# EasyEDA Pro project ProPrj_阿加犀_2025-08-19.epro

# Schematic Schematic1
Board Name: Holiday; Create Date: 2025-07-15; Page Name: P1; Project Name: 阿加犀; Schematic Name: Schematic1; Update Date: 2025-07-24; Company: 嘉立创EDA; Page Size: A4; Version: V1.0
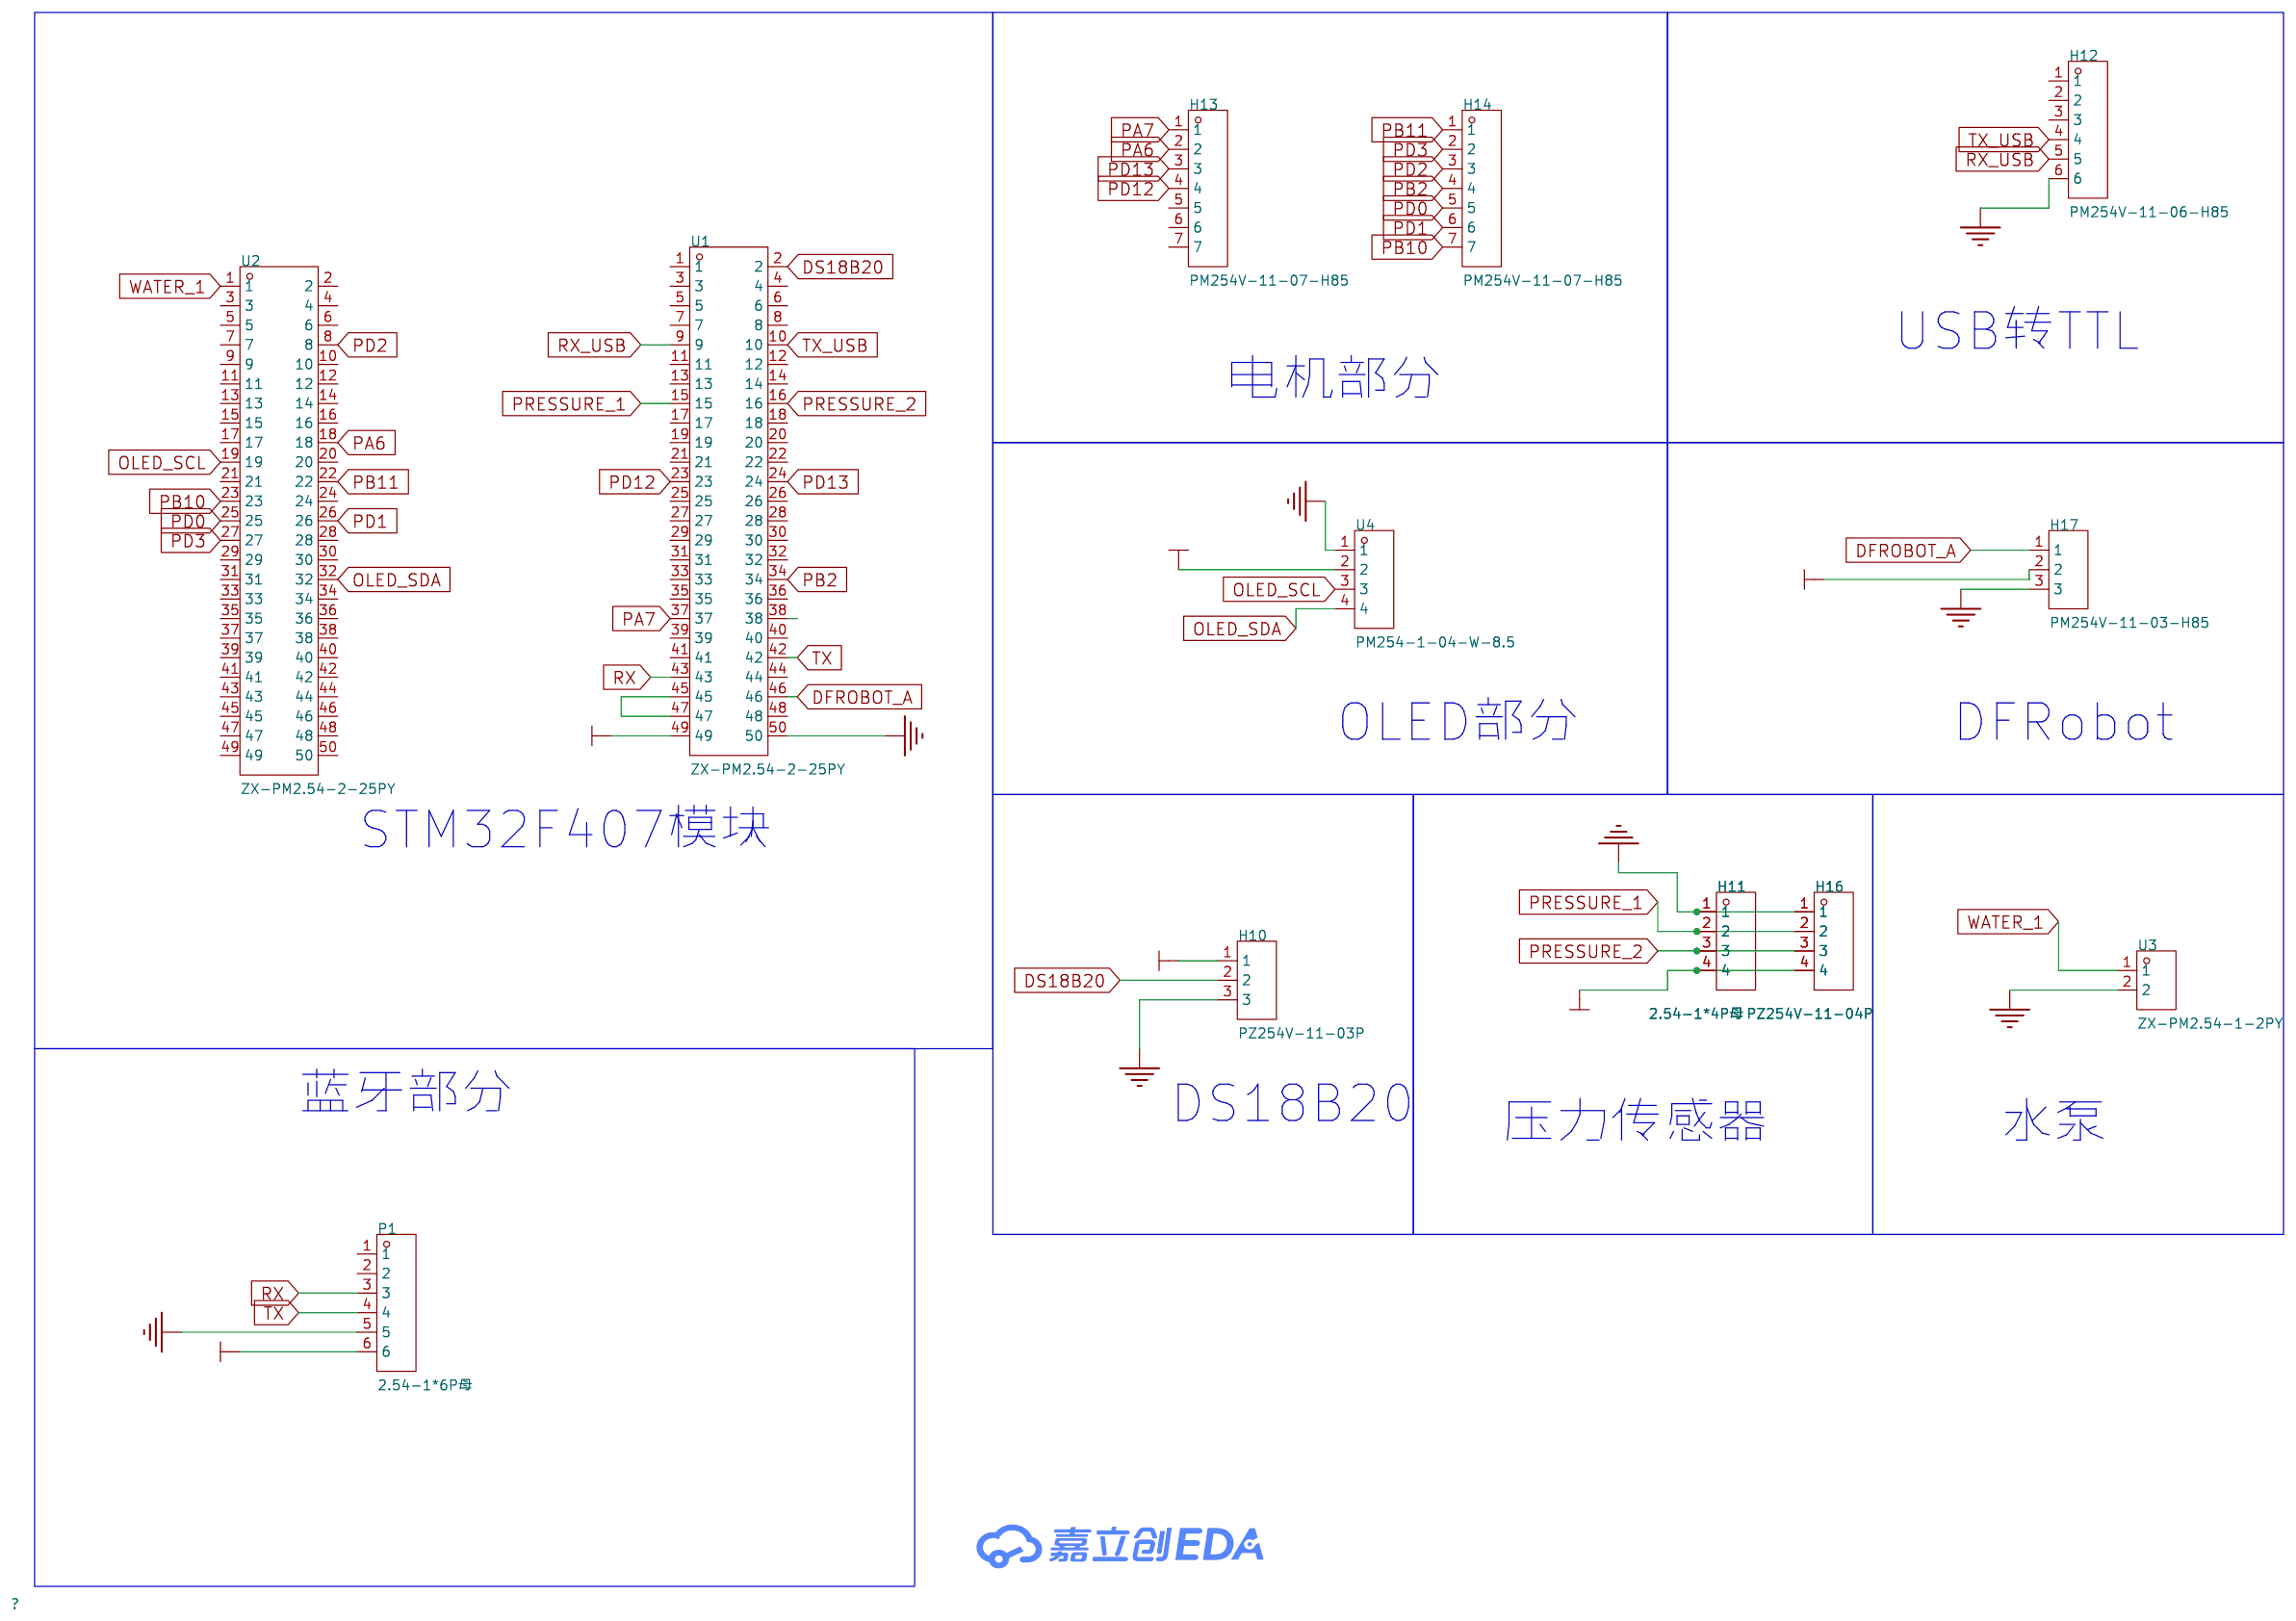
[diagram p0: schematic sheet]

## Parts
H10  PZ254V-11-03P  [HDR-TH_3P-P2.54-V-M]
H11  2.54-1*4P母  [HDR-TH_4P-P2.54-V-F]
H12  PM254V-11-06-H85  [HDR-TH_6P-P2.54-V-F]
H13  PM254V-11-07-H85  [HDR-TH_7P-P2.54-V-F]
H14  PM254V-11-07-H85  [HDR-TH_7P-P2.54-V-F]
H16  PZ254V-11-04P  [HDR-TH_4P-P2.54-V-M]
H17  PM254V-11-03-H85  [HDR-TH_3P-P2.54-V-F]
P1  2.54-1*6P母  [HDR-TH_6P-P2.54-V-F]
U1  ZX-PM2.54-2-25PY  [HDR-TH_50P-P2.54-V-F-R2-C25-S2.54-1]
U2  ZX-PM2.54-2-25PY  [HDR-TH_50P-P2.54-V-F-R2-C25-S2.54-1]
U3  ZX-PM2.54-1-2PY  [HDR-TH_2P-P2.54-V-F]
U4  PM254-1-04-W-8.5  [HDR-TH_4P-P2.54-H-F-W10.0-N]

## Library data of the parts
H10 = PZ254V-11-03P: 插针结构:1x3P;间距:2.54mm;行距:-;圆针/方针:方针;安装方式:直插;排数:单排;总PIN位数:3P;额定电流:3A;额定电压:250V;配合针长度:6mm;塑高:2.5mm;端接针长度:3mm;工作温度:-40℃~+105℃;颜色:黑色;; LCSC Part Name: 1x3P 间距:2.54mm 方针 直插; Supplier Part: C2937625; Manufacturer: XFCN(兴飞); Supplier Footprint: 插件,P=2.54mm; JLCPCB Part Class: 扩展库; Datasheet: https://atta.szlcsc.com/upload/public/pdf/source/20200309/C492402_8335C3D49C4E4C618838D59BB1D024C1.pdf; Supplier: LCSC; Pin Structure: 1x3P; Pitch: 2.54mm; Circluar Pins/Square Pins: 方针; Mounting Type: 直插; Number of Rows: 单排; Number of Pins: 3P; Current Rating: 3A; Voltage Rating (Max): 250V; Length of Mating Pin: 6mm; Insulation Height: 2.5mm; Length of End Connection Pin: 3mm; Operating Temperature: -40℃~+105℃; Color: 黑色
H11 = 2.54-1*4P母: 插孔结构:1x4P;间距:2.54mm;行距:-;圆孔/方孔:方孔;安装类型:直插;排数:单排;总孔位数:4P;额定电流:3A;额定电压:-;插孔方向:顶部;塑高:-;触头材质:青铜;触头镀层:-;工作温度范围:-40℃~+105℃;焊接温度(最大值):-;; LCSC Part Name: 间距:2.54mm 1x4P 直插; Supplier Part: C2718488; Manufacturer: BOOMELE(博穆精密); Supplier Footprint: 插件,P=2.54mm; JLCPCB Part Class: 扩展库; Datasheet: https://atta.szlcsc.com/upload/public/pdf/source/20210301/C2718488_F4427B881E42CAA8DDB0B1C12B3A522C.pdf; Supplier: LCSC; Holes Structure: 1x4P; Pitch: 2.54mm; Circular Hole / Square Hole: 方孔; Mounting Type: 直插; Number of Rows: 单排; Number of Holes: 4P; Current Rating (Max): 3A; Holes Direction: 顶部; Contact Material: 青铜; Operating Temperature Range: -40℃~+105℃
H12 = PM254V-11-06-H85: 插孔结构:1x6P;间距:2.54mm;行距:-;圆孔/方孔:方孔;安装类型:直插;排数:单排;总孔位数:6P;额定电流:3A;额定电压:250V;插孔方向:顶部;塑高:-;工作温度范围:-40℃~+105℃;; LCSC Part Name: 间距:2.54mm 1x6P 直插; Supplier Part: C2832269; Manufacturer: XFCN(兴飞); Supplier Footprint: 插件,P=2.54mm; JLCPCB Part Class: 扩展库; Datasheet: https://atta.szlcsc.com/upload/public/pdf/source/20210514/C2832269_B3EC97736B37C2783BDCE3050AA57447.pdf; Supplier: LCSC; Holes Structure: 1x6P; Pitch: 2.54mm; Circular Hole / Square Hole: 方孔; Mounting Type: 直插; Number of Rows: 单排; Number of Holes: 6P; Current Rating (Max): 3A; Voltage Rating (Max): 250V; Holes Direction: 顶部; Operating Temperature Range: -40℃~+105℃
H13 H14 = PM254V-11-07-H85: 插孔结构:1x7P;间距:2.54mm;行距:-;圆孔/方孔:方孔;安装类型:直插;排数:单排;总孔位数:7P;额定电流:3A;额定电压:250V;插孔方向:顶部;塑高:-;工作温度范围:-40℃~+105℃;; LCSC Part Name: 间距:2.54mm 1x7P 直插; Supplier Part: C2832270; Manufacturer: XFCN(兴飞); Supplier Footprint: 插件,P=2.54mm; JLCPCB Part Class: 扩展库; Datasheet: https://atta.szlcsc.com/upload/public/pdf/source/20210514/C2832270_F424CC0071A81298BFB56B53406F9842.pdf; Supplier: LCSC; Holes Structure: 1x7P; Pitch: 2.54mm; Circular Hole / Square Hole: 方孔; Mounting Type: 直插; Number of Rows: 单排; Number of Holes: 7P; Current Rating (Max): 3A; Voltage Rating (Max): 250V; Holes Direction: 顶部; Operating Temperature Range: -40℃~+105℃
H16 = PZ254V-11-04P: 插针结构:1x4P;间距:2.54mm;行距:-;圆针/方针:方针;安装类型:直插;排数:单排;总PIN位数:4P;额定电流:3A;额定电压:250V;配合针长度:6mm;塑高:2.5mm;端接针长度:3mm;触头材质:-;工作温度范围:-40℃~+105℃;颜色:黑色;; LCSC Part Name: 间距:2.54mm 1x4P 直插 方针; Supplier Part: C2691448; Manufacturer: XFCN(兴飞); Supplier Footprint: 插件,P=2.54mm; JLCPCB Part Class: 扩展库; Datasheet: https://atta.szlcsc.com/upload/public/pdf/source/20200309/C492403_F9F19131791D08044AD4F84F8E751A34.pdf; Supplier: LCSC; Pin Structure: 1x4P; Pitch: 2.54mm; Circluar Pins/Square Pins: 方针; Mounting Type: 直插; Number of Rows: 单排; Number of Pins: 4P; Current Rating (Max): 3A; Voltage Rating (Max): 250V; Length of Mating Pin: 6mm; Insulation Height: 2.5mm; Length of End Connection Pin: 3mm; Operating Temperature Range: -40℃~+105℃; Color: 黑色
H17 = PM254V-11-03-H85: 插孔结构:1x3P;间距:2.54mm;行距:-;安装类型:直插;排数:单排;总孔位数:3P;塑高:-;触头材质:黄铜;触头镀层:-;; LCSC Part Name: 间距:2.54mm 1x3P 直插; Supplier Part: C541850; Manufacturer: XFCN(兴飞); Supplier Footprint: 插件,P=2.54mm; JLCPCB Part Class: 扩展库; Datasheet: https://atta.szlcsc.com/upload/public/pdf/source/20200518/C541849_85853D71FC67C51915A806977A588FDA.pdf; Supplier: LCSC; Holes Structure: 1x3P; Pitch: 2.54mm; Mounting Type: 直插; Number of Rows: 单排; Number of Holes: 3P; Contact Material: 黄铜
P1 = 2.54-1*6P母: 插孔结构:1x6P;间距:2.54mm;行距:-;安装类型:直插;排数:单排;总孔位数:6P;塑高:-;触头材质:-;触头镀层:-;; LCSC Part Name: 间距:2.54mm 1x6P 直插; Supplier Part: C40877; Manufacturer: BOOMELE(博穆精密); Supplier Footprint: 插件,P=2.54mm; JLCPCB Part Class: 扩展库; Datasheet: https://atta.szlcsc.com/upload/public/pdf/source/20210301/C2718488_F4427B881E42CAA8DDB0B1C12B3A522C.pdf; Supplier: LCSC; Holes Structure: 1x6P; Pitch: 2.54mm; Mounting Type: 直插; Number of Rows: 单排; Number of Holes: 6P
U1 U2 = ZX-PM2.54-2-25PY: 插孔结构:2x25P;间距:2.54mm;行距:2.54mm;圆孔/方孔:方孔;安装方式:直插;排数:双排;总孔位数:50P;额定电流:3A;额定电压:-;插孔方向:顶部;塑高:8.5mm;触头材质:-;触头镀层:金;工作温度:-40℃~+105℃;; LCSC Part Name: 2x25P 间距:2.54mm 直插; Supplier Part: C7499355; Manufacturer: Megastar(兆星); Supplier Footprint: 插件,P=2.54mm; JLCPCB Part Class: 扩展库; Datasheet: https://atta.szlcsc.com/upload/public/pdf/source/20231122/49E5BFC403566950E1C41AC60FCE7E93.pdf; Supplier: LCSC; Holes Structure: 2x25P; Pitch: 2.54mm; Row Spacing: 2.54mm; Circular Hole / Square Hole: 方孔; Mounting Type: 直插; Number of Rows: 双排; Number of Positions: 50P; Current Rating: 3A; Holes Direction: 顶部; Insulation Height: 8.5mm; Contact Plating: 金; Operating Temperature: -40℃~+105℃; PIN Length: 3.2mm
U3 = ZX-PM2.54-1-2PY: 插孔结构:1x2P;间距:2.54mm;行距:-;圆孔/方孔:方孔;安装方式:直插;排数:单排;总孔位数:2P;额定电流:3A;额定电压:-;插孔方向:顶部;塑高:8.5mm;触头材质:-;触头镀层:金;工作温度:-40℃~+105℃;; LCSC Part Name: 1x2P 间距:2.54mm 直插; Supplier Part: C7499322; Manufacturer: Megastar(兆星); Supplier Footprint: 插件,P=2.54mm; JLCPCB Part Class: 扩展库; Datasheet: https://atta.szlcsc.com/upload/public/pdf/source/20231122/F22175ABE3DCBFEB9E36A2E7DA44623C.pdf; Supplier: LCSC; Holes Structure: 1x2P; Pitch: 2.54mm; Circular Hole / Square Hole: 方孔; Mounting Type: 直插; Number of Rows: 单排; Number of Positions: 2P; Current Rating: 3A; Holes Direction: 顶部; Insulation Height: 8.5mm; Contact Plating: 金; Operating Temperature: -40℃~+105℃; PIN Length: 3.2mm
U4 = PM254-1-04-W-8.5: 插孔结构:1x4P;间距:2.54mm;行距:-;圆孔/方孔:方孔;安装类型:弯插;排数:单排;总孔位数:4P;额定电流:3A;额定电压:-;插孔方向:侧面;塑高:8.5mm;触头材质:铜合金;工作温度范围:-40℃~+105℃;焊接温度(最大值):260℃@5S;; LCSC Part Name: 1x4P 间距:2.54mm 弯插; Supplier Part: C2897386; Manufacturer: HCTL(华灿天禄); Supplier Footprint: 弯插,P=2.54mm; JLCPCB Part Class: 扩展库; Datasheet: https://atta.szlcsc.com/upload/public/pdf/source/20230609/7BA40A3D721268A082DCDEAD4C99131B.pdf; Supplier: LCSC; Holes Structure: 1x4P; Pitch: 2.54mm; Circular Hole / Square Hole: 方孔; Mounting Type: 弯插; Number of Rows: 单排; Number of Holes: 4P; Current Rating (Max): 3A; Holes Direction: 侧面; Insulation Height: 8.5mm; Contact Material: 铜合金; Operating Temperature Range: -40℃~+105℃; Soldering Temperature(Max): 260℃@5S

## Nets
3.3V: H10.1 H11.4 H16.4 H17.2 P1.6 U1.49 U4.2
GND: H10.3 H11.1 H12.6 H16.1 H17.3 P1.5 U1.50 U3.2 U4.1
DFROBOT_A: H17.1 U1.46
DS18B20: H10.2 U1.2
OLED_SCL: U2.19 U4.3
OLED_SDA: U2.32 U4.4
PA6: H13.2 U2.18
PA7: H13.1 U1.37
PB2: H14.4 U1.34
PB10: H14.7 U2.23
PB11: H14.1 U2.22
PD0: H14.5 U2.25
PD1: H14.6 U2.26
PD2: H14.3 U2.8
PD3: H14.2 U2.27
PD12: H13.4 U1.23
PD13: H13.3 U1.24
PRESSURE_1: H11.2 H16.2 U1.15
PRESSURE_2: H11.3 H16.3 U1.16
RX: P1.3 U1.43
RX_USB: H12.5 U1.9
TX: P1.4 U1.42
TX_USB: H12.4 U1.10
WATER_1: U2.1 U3.1
$1N4979: U1.45 U1.47

Not connected (* = marked no-connect by the designer): H12 1 2 3; H13 5 6 7; P1 1 2; U1 1 3 4 5 6 7 8 11 12 13 14 17 18 19 20 21 22 25 26 27 28 29 30 31 32 33 35 36 38 39 40 41 44 48; U2 2 3 4 5 6 7 9 10 11 12 13 14 15 16 17 20 21 24 28 29 30 31 33 34 35 36 37 38 39 40 41 42 43 44 45 46 47 48 49 50

## Notes on the sheet
- USB转TTL
- 电机部分
- OLED部分
- DFRobot
- STM32F407模块
- 蓝牙部分
- DS18B20
- 压力传感器
- 水泵

# Board PCB1
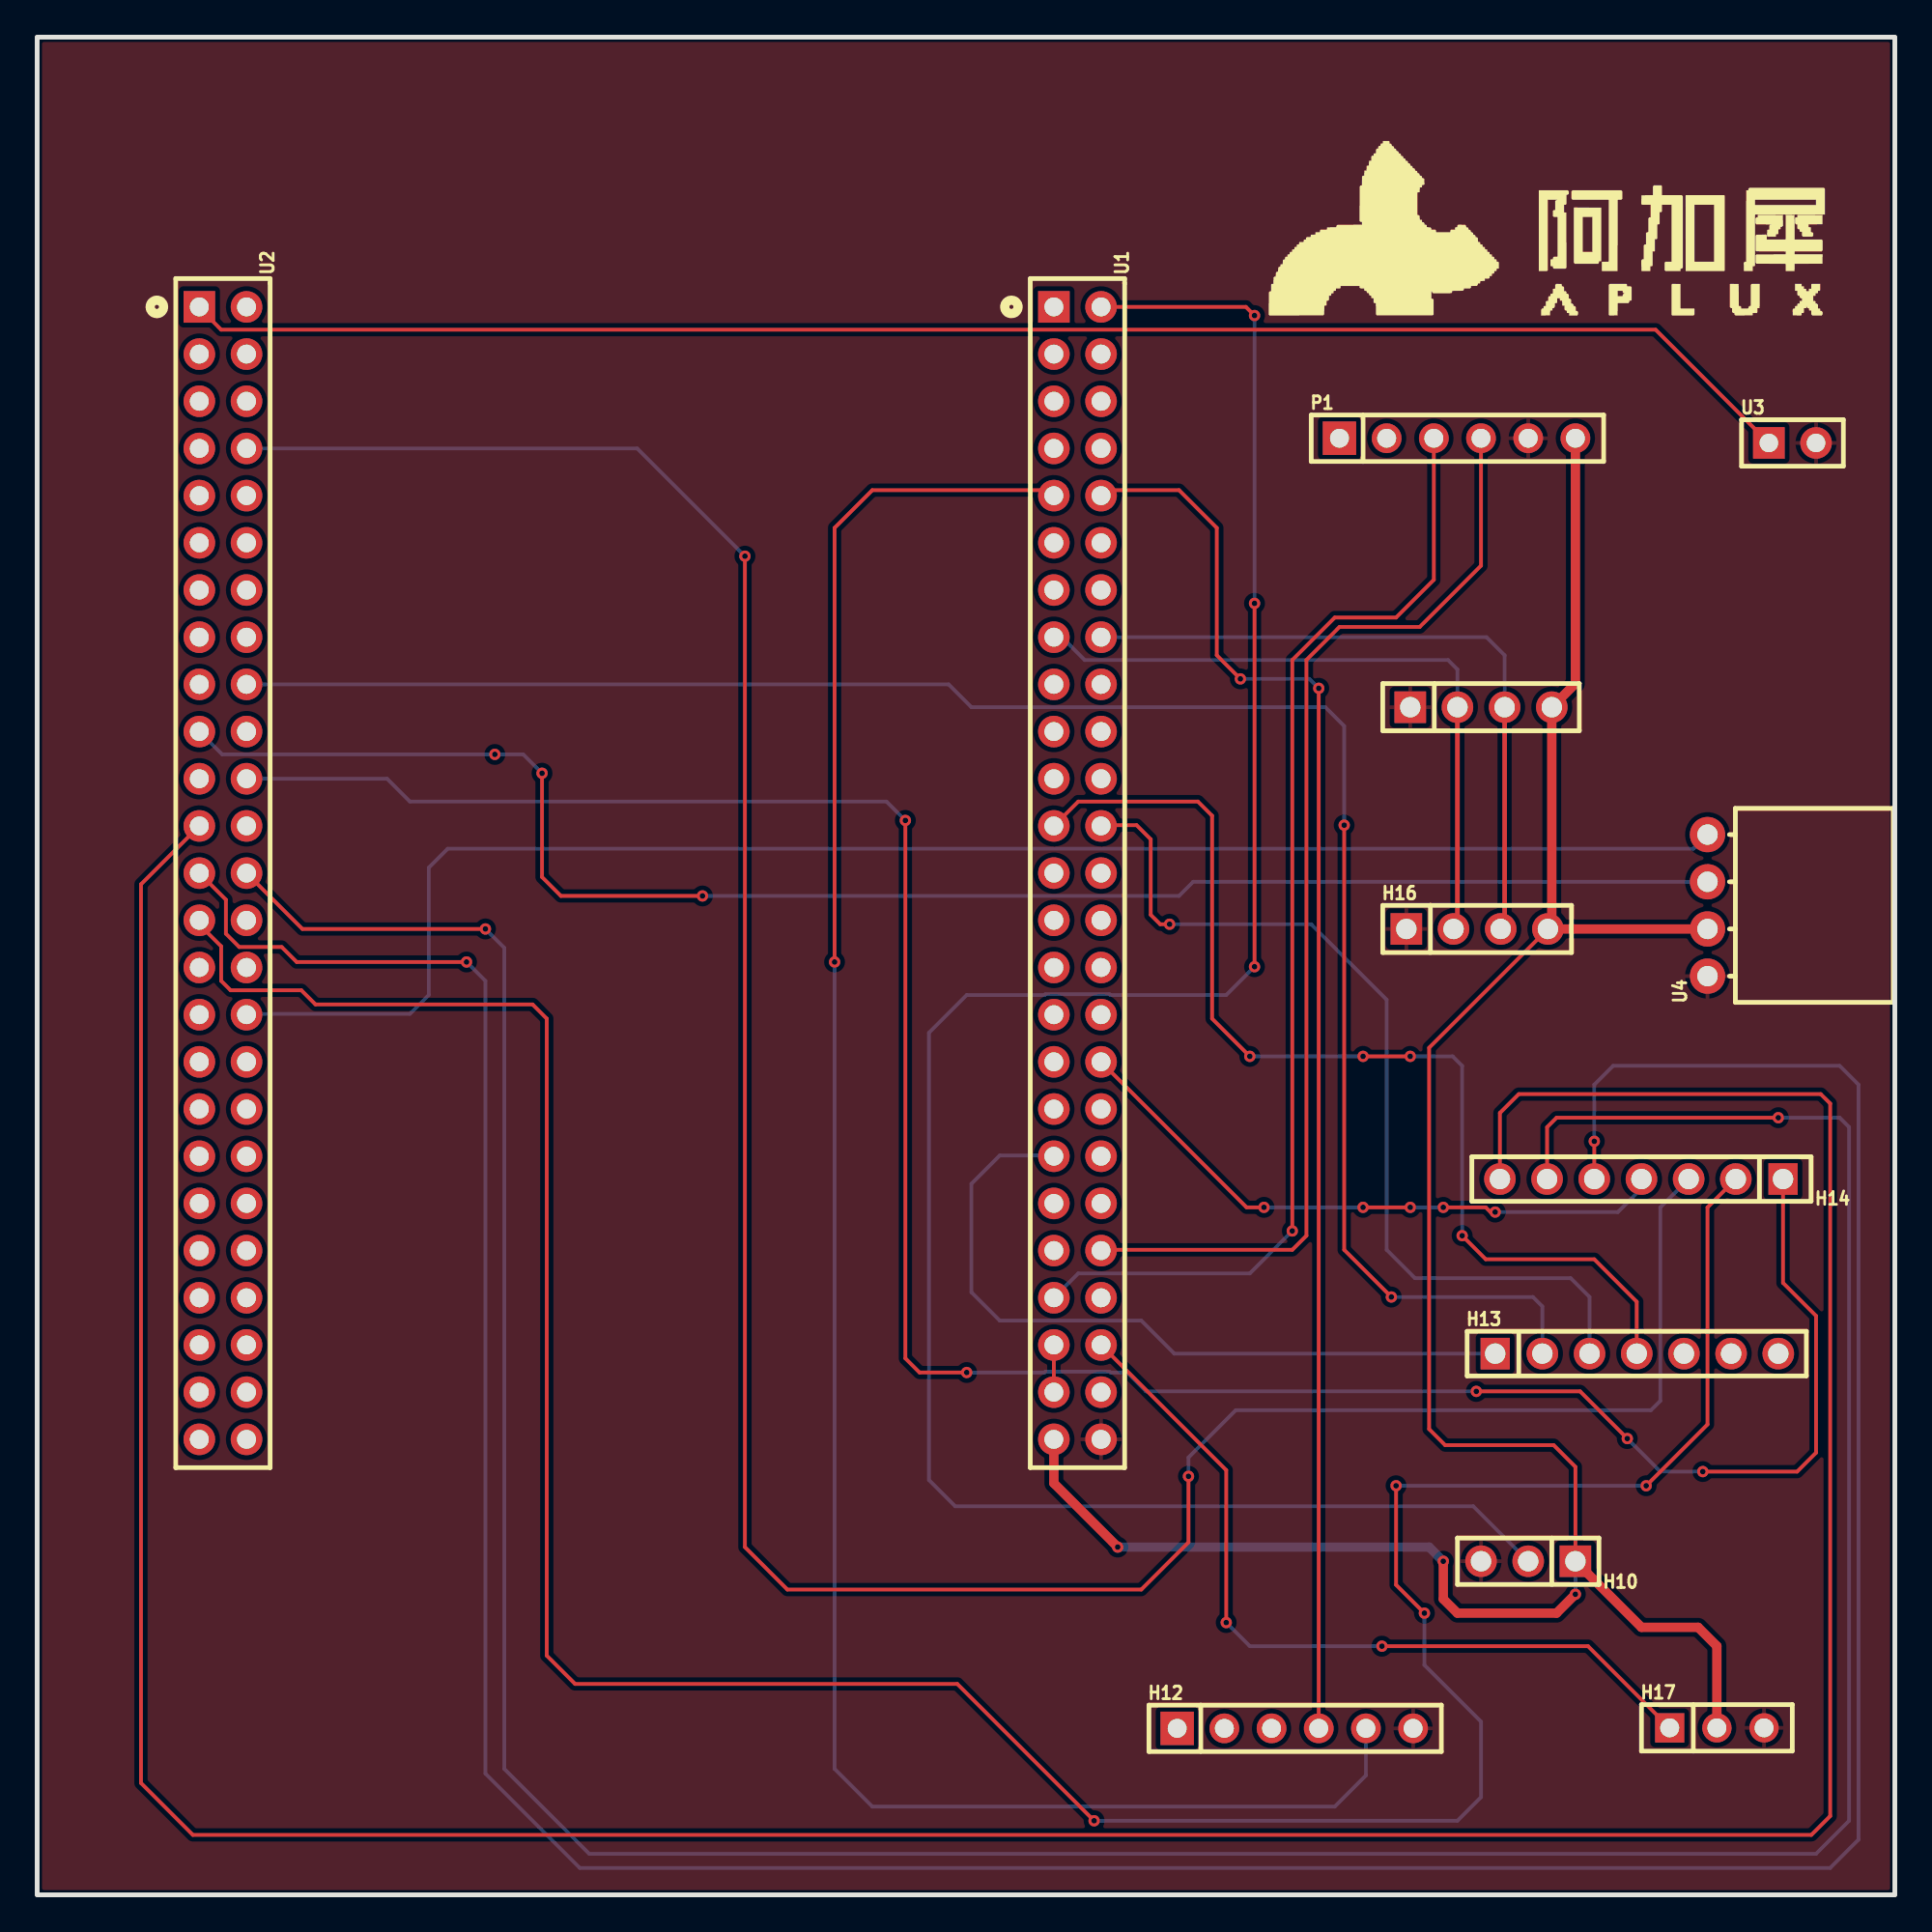
[diagram p1: board, top side]
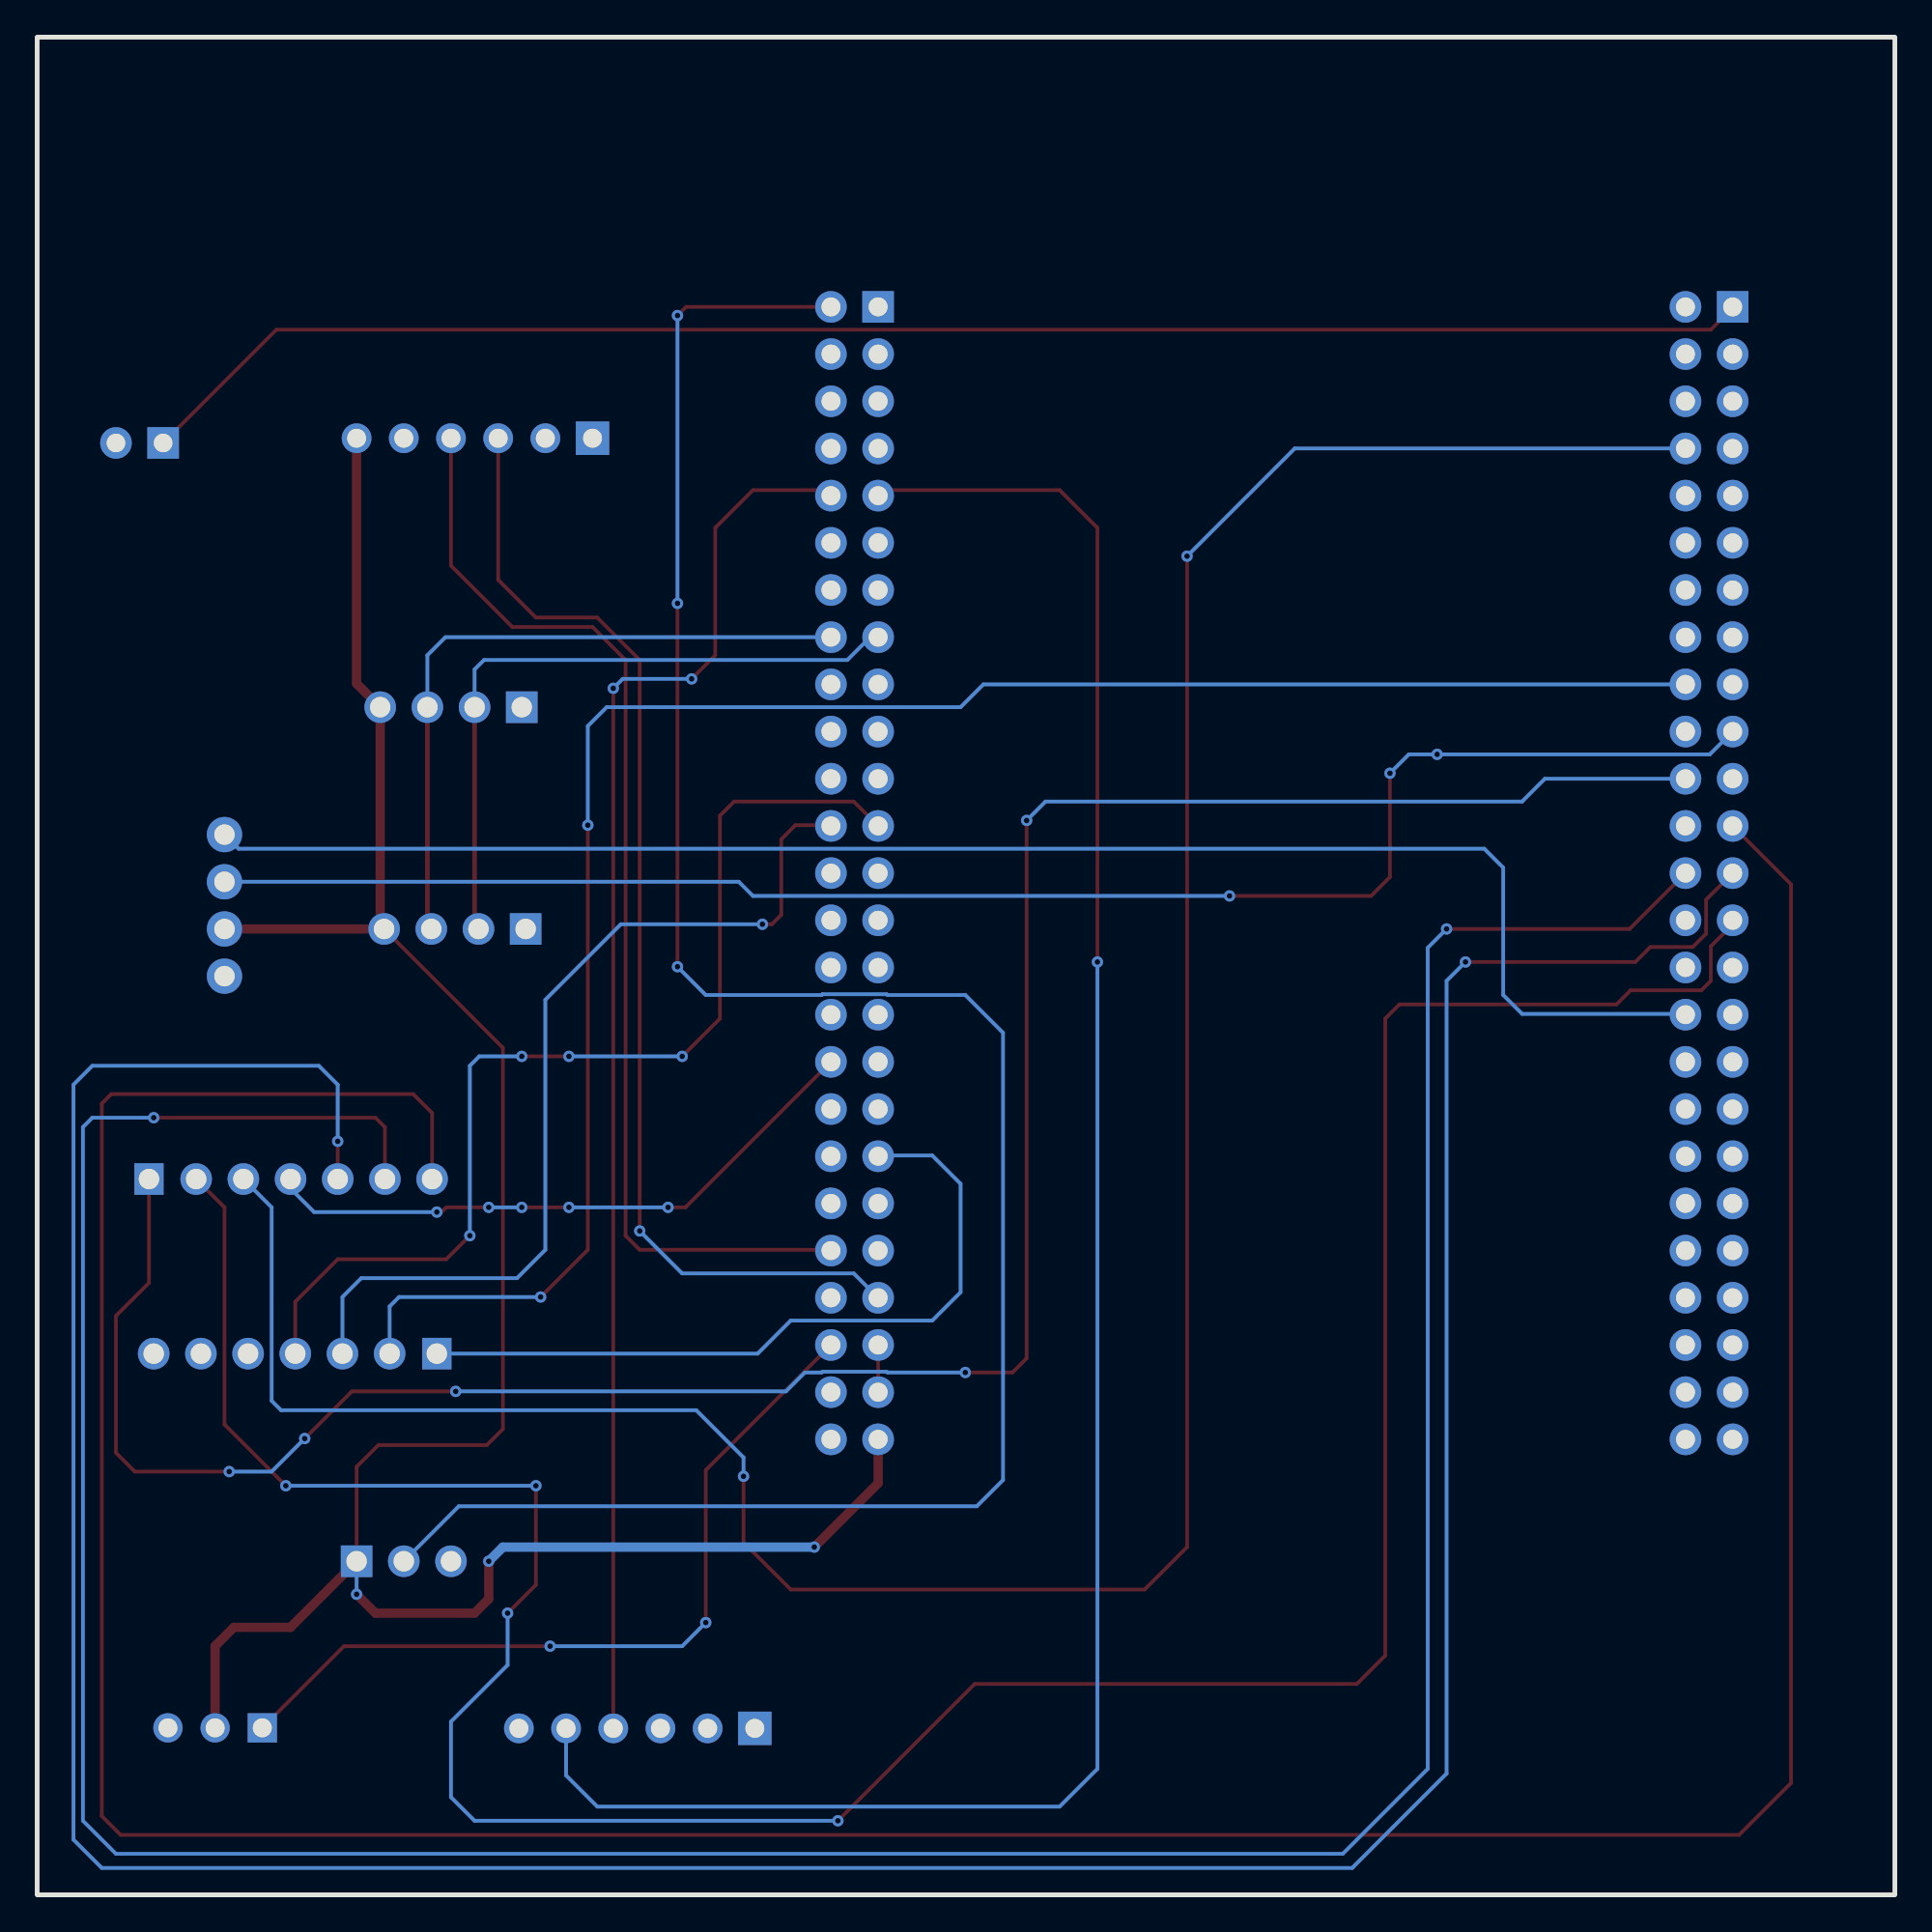
[diagram p2: board, bottom side, seen from below]

Outline 100 x 100 mm; copper layers: Top Layer, Bottom Layer. Coordinates in mm from the lower left corner of the outline.
Outline path: rectangle 0,100 100,0
Stack: Top Layer 0.035mm / Dielectric1 1.51mm FR4 er 4.5 / Bottom Layer 0.035mm

## Design rules (mm)
template: JLCPCB Capability(Two Layers Board)
spacing copperThickness1oz (default): track to track 0.102, other pairs 0.152 to 0.3
spacing copperThickness2oz: track to track 0.203, other pairs 0.152 to 0.3
track width copperThickness1oz (default): min 0.127, default 0.254, max 2.54
track width copperThickness2oz: min 0.203, default 0.254, max 2.54
differential pair differentialPair (default): width min 0.127, default 0.254, max 2.54; gap min 0.152, default 0.152
via viaSize (default): diameter min 0.5, default 0.61, max 10; hole min 0.3, default 0.305, max 6.3

## Placement (name value [footprint] x y rotation side)
H10  PZ254V-11-03P  [HDR-TH_3P-P2.54-V-M]  80.26 17.96 180 top
H11  2.54-1*4P母  [HDR-TH_4P-P2.54-V-F]  77.72 63.93 0 top
H12  PM254V-11-06-H85  [HDR-TH_6P-P2.54-V-F]  67.72 8.96 0 top
H13  PM254V-11-07-H85  [HDR-TH_7P-P2.54-V-F]  86.11 29.13 0 top
H14  PM254V-11-07-H85  [HDR-TH_7P-P2.54-V-F]  86.36 38.53 180 top
H16  PZ254V-11-04P  [HDR-TH_4P-P2.54-V-M]  77.51 51.99 0 top
H17  PM254V-11-03-H85  [HDR-TH_3P-P2.54-V-F]  90.42 8.99 0 top
P1  2.54-1*6P母  [HDR-TH_6P-P2.54-V-F]  76.45 78.41 0 top
U1  ZX-PM2.54-2-25PY  [HDR-TH_50P-P2.54-V-F-R2-C25-S2.54-1]  56 55 270 top
U2  ZX-PM2.54-2-25PY  [HDR-TH_50P-P2.54-V-F-R2-C25-S2.54-1]  10 55 270 top
U3  ZX-PM2.54-1-2PY  [HDR-TH_2P-P2.54-V-F]  94.49 78.16 0 top
U4  PM254-1-04-W-8.5  [HDR-TH_4P-P2.54-H-F-W10.0-N]  89.92 53.26 90 top

## Footprints (pads in the part's own frame, mm; a bottom-side part is the same pattern mirrored in y, then rotated)
HDR-TH_2P-P2.54-V-F
  rect 1.7x1.7 hole 1: 1(-1.27,0)
  round 1.7 hole 1: 2(1.27,0)
HDR-TH_3P-P2.54-V-F
  rect 1.575x1.575 hole 1.02: 1(-2.54,0)
  round 1.575 hole 1.02: 2(0,0) 3(2.54,0)
HDR-TH_3P-P2.54-V-M
  rect 1.7x1.7 hole 1.1: 1(-2.54,0)
  round 1.7 hole 1.1: 2(0,0) 3(2.54,0)
HDR-TH_4P-P2.54-H-F-W10.0-N
  round 1.9 hole 1.1: 1(-3.81,0) 2(-1.27,0) 3(1.27,0) 4(3.81,0)
HDR-TH_4P-P2.54-V-F
  rect 1.7x1.7 hole 1.1: 1(-3.81,0)
  round 1.7 hole 1.1: 2(-1.27,0) 3(1.27,0) 4(3.81,0)
HDR-TH_4P-P2.54-V-M
  rect 1.7x1.7 hole 1.1: 1(-3.81,0)
  round 1.7 hole 1.1: 2(-1.27,0) 3(1.27,0) 4(3.81,0)
HDR-TH_6P-P2.54-V-F
  rect 1.8x1.8 hole 1.02: 1(-6.35,0)
  round 1.6 hole 1.02: 2(-3.81,0) 3(-1.27,0) 4(1.27,0) 5(3.81,0) 6(6.35,0)
HDR-TH_7P-P2.54-V-F
  rect 1.575x1.7 hole 1.1: 1(-7.62,0)
  round 1.7 hole 1.1: 2(-5.08,0) 3(-2.54,0) 4(0,0) 5(2.54,0) 6(5.08,0) 7(7.62,0)
HDR-TH_50P-P2.54-V-F-R2-C25-S2.54-1
  rect 1.7x1.7 hole 1.02: 1(-30.48,-1.27)
  round 1.7 hole 1.02: 2(-30.48,1.27) 3(-27.94,-1.27) 4(-27.94,1.27) 5(-25.4,-1.27) 6(-25.4,1.27) 7(-22.86,-1.27) 8(-22.86,1.27) 9(-20.32,-1.27) 10(-20.32,1.27) 11(-17.78,-1.27) 12(-17.78,1.27) 13(-15.24,-1.27) 14(-15.24,1.27) 15(-12.7,-1.27) 16(-12.7,1.27) 17(-10.16,-1.27) 18(-10.16,1.27) 19(-7.62,-1.27) 20(-7.62,1.27) 21(-5.08,-1.27) 22(-5.08,1.27) 23(-2.54,-1.27) 24(-2.54,1.27) 25(0,-1.27) 26(0,1.27) 27(2.54,-1.27) 28(2.54,1.27) 29(5.08,-1.27) 30(5.08,1.27) 31(7.62,-1.27) 32(7.62,1.27) 33(10.16,-1.27) 34(10.16,1.27) 35(12.7,-1.27) 36(12.7,1.27) 37(15.24,-1.27) 38(15.24,1.27) 39(17.78,-1.27) 40(17.78,1.27) 41(20.32,-1.27) 42(20.32,1.27) 43(22.86,-1.27) 44(22.86,1.27) 45(25.4,-1.27) 46(25.4,1.27) 47(27.94,-1.27) 48(27.94,1.27) 49(30.48,-1.27) 50(30.48,1.27)

## Nets
As in the schematic.

Pads without a net: H12 1 2 3; H13 5 6 7; P1 1 2; U1 1 3 4 5 6 7 8 11 12 13 14 17 18 19 20 21 22 25 26 27 28 29 30 31 32 33 35 36 39 40 41 44 48; U2 2 3 4 5 6 7 9 10 11 12 13 14 15 16 17 20 21 24 28 29 30 31 33 34 35 36 37 38 39 40 41 42 43 44 45 46 47 48 49 50

## Via types
v1: diameter 0.61, hole 0.305, Top Layer to Bottom Layer, 42 vias

## Routing (per net, layer and track width the routed paths; a pad name or vN(x,y) marks a point on that pad's centre or on a via; arc(x,y) is an arc through that point)
3.3V: length 129.6
  Top Layer w0.2: H16.4 74.93,45.6 74.93,25.07 75.79,24.21 81.63,24.21 82.8,23.04 H10.1
  Top Layer w0.5: H10.1 86.36,14.4 89.41,14.4 90.42,13.39 H17.2 ; U1.49 54.73,22.16 v1(58.17,18.72) ; v1(82.8,16.18) 81.79,15.16 76.45,15.16 75.69,15.93 v1(75.69,17.96) ; U4.2 H16.4 81.53,52.2 H11.4 82.8,65.2 P1.6
  Bottom Layer w0.2: v1(82.8,16.18) H10.1
  Bottom Layer w0.5: v1(58.17,18.72) 74.93,18.72 v1(75.69,17.96)
DFROBOT_A: length 44
  Top Layer w0.2: v1(64.01,14.66) 64.01,22.86 U1.46 ; v1(72.39,13.39) 83.48,13.39 H17.1
  Bottom Layer w0.2: v1(64.01,14.66) 65.28,13.39 v1(72.39,13.39)
DS18B20: length 120.7
  Top Layer w0.2: v1(65.53,69.52) v1(65.53,49.96) ; v1(65.53,85.01) 65.07,85.48 U1.2
  Bottom Layer w0.2: v1(65.53,85.01) v1(65.53,69.52) ; H10.2 77.3,20.92 49.42,20.92 48.01,22.33 48.01,46.41 50.04,48.44 54.23,48.44 54.27,48.48 57.73,48.48 57.77,48.44 64.01,48.44 v1(65.53,49.96)
OLED_SCL: length 88.4
  Top Layer w0.2: v1(27.18,60.38) 27.18,54.79 28.19,53.77 v1(35.81,53.77)
  Bottom Layer w0.2: U4.3 62.23,54.53 61.47,53.77 v1(35.81,53.77) ; v1(27.18,60.38) 26.16,61.39 v1(24.64,61.39) 9.96,61.39 U2.19
OLED_SDA: length 86.7
  Bottom Layer w0.2: U2.32 11.31,47.42 20.07,47.42 21.08,48.44 21.08,55.3 22.1,56.31 89.15,56.31 U4.4
PA6: length 102.7
  Top Layer w0.2: v1(72.9,32.18) 70.36,34.72 v1(70.36,57.58)
  Bottom Layer w0.2: v1(72.9,32.18) 80.52,32.18 81.03,31.67 H13.2 ; U2.18 49.06,65.16 50.29,63.93 69.34,63.93 70.36,62.92 v1(70.36,57.58)
PA7: length 40.5
  Bottom Layer w0.2: U1.37 54.69,39.8 51.82,39.8 50.29,38.28 50.29,32.44 51.82,30.91 59.44,30.91 61.21,29.13 H13.1
PB2: length 33.5
  Top Layer w0.2: v1(71.37,37.01) v1(73.91,37.01) ; U1.34 65.1,37.01 v1(66.04,37.01) ; v1(75.69,37.01) 77.98,37.01 78.23,36.75 v1(78.49,36.75)
  Bottom Layer w0.2: v1(66.04,37.01) v1(71.37,37.01) ; v1(78.49,36.75) 85.09,36.75 86.36,38.02 H14.4 ; v1(73.91,37.01) v1(75.69,37.01)
PB10: length 205.7
  Top Layer w0.2: H14.7 78.74,42.09 79.76,43.1 96.01,43.1 96.52,42.6 96.52,4.24 95.5,3.23 8.38,3.23 5.59,6.02 5.59,54.4 U2.23
PB11: length 132.8
  Top Layer w0.2: H14.1 93.98,32.94 95.76,31.17 95.76,23.8 94.74,22.78 v1(89.66,22.78) ; v1(46.74,57.84) 46.74,28.88 47.5,28.12 v1(50.04,28.12) ; v1(77.47,27.1) 83.06,27.1 v1(85.6,24.56)
  Bottom Layer w0.2: v1(46.74,57.84) 45.72,58.85 20.07,58.85 18.84,60.08 U2.22 ; v1(50.04,28.12) 54.23,28.12 54.27,28.16 57.73,28.16 57.77,28.12 58.67,28.12 59.69,27.1 v1(77.47,27.1) ; v1(89.66,22.78) 87.38,22.78 v1(85.6,24.56)
PD0: length 199
  Top Layer w0.2: H14.5 v1(83.82,40.56) ; v1(23.11,50.22) 13.97,50.22 13.16,51.02 10.88,51.02 10.16,51.74 10.16,53.57 U2.25
  Bottom Layer w0.2: v1(23.11,50.22) 24.13,49.2 24.13,6.53 29.21,1.45 96.52,1.45 98.04,2.97 98.04,43.61 97.03,44.63 84.84,44.63 83.82,43.61 v1(83.82,40.56)
PD1: length 191.6
  Top Layer w0.2: v1(93.73,41.83) 81.79,41.83 81.28,41.33 H14.6 ; v1(24.13,51.99) 14.28,51.99 U2.26
  Bottom Layer w0.2: v1(24.13,51.99) 25.15,50.98 25.15,6.78 29.72,2.21 95.76,2.21 97.54,3.99 97.54,41.33 97.03,41.83 v1(93.73,41.83)
PD2: length 152.3
  Top Layer w0.2: v1(61.98,22.53) 61.98,18.97 59.44,16.43 40.39,16.43 38.1,18.72 v1(38.1,72.06)
  Bottom Layer w0.2: H14.3 87.38,37.01 87.38,26.59 86.87,26.09 64.52,26.09 61.98,23.55 v1(61.98,22.53) ; v1(38.1,72.06) 32.3,77.86 U2.8
PD3: length 161.5
  Top Layer w0.2: v1(56.9,3.99) 49.53,11.35 28.96,11.35 27.43,12.88 27.43,47.17 26.67,47.93 14.99,47.93 14.22,48.69 10.41,48.69 9.91,49.2 9.91,51.06 9.14,51.82 9.14,52.05 U2.27 ; v1(86.61,22.02) 89.92,25.32 89.92,37.01 H14.2 ; v1(73.15,22.02) 73.15,16.69 v1(74.68,15.16)
  Bottom Layer w0.2: v1(74.68,15.16) 74.68,12.37 77.72,9.32 77.72,5.26 76.45,3.99 v1(56.9,3.99) ; v1(86.61,22.02) v1(73.15,22.02)
PD12: length 57.6
  Top Layer w0.2: H13.4 86.11,31.93 83.82,34.21 77.98,34.21 v1(76.71,35.48) ; v1(71.37,45.14) v1(73.91,45.14) ; U1.23 56.04,58.85 62.48,58.85 63.25,58.09 63.25,47.17 v1(65.28,45.14)
  Bottom Layer w0.2: v1(65.28,45.14) v1(71.37,45.14) ; v1(76.71,35.48) 76.71,44.63 76.2,45.14 v1(73.91,45.14)
PD13: length 50.1
  Top Layer w0.2: U1.24 57.31,57.58 59.18,57.58 59.94,56.82 59.94,52.76 60.45,52.25 v1(60.96,52.25)
  Bottom Layer w0.2: v1(60.96,52.25) 68.58,52.25 72.64,48.18 72.64,34.72 74.17,33.2 82.55,33.2 83.57,32.18 H13.3
PRESSURE_1: length 36.5
  Top Layer w0.25: H16.2 76.45,52.2 H11.2
  Bottom Layer w0.2: U1.15 55.16,67.7 56.39,66.47 75.95,66.47 76.45,65.96 H11.2
PRESSURE_2: length 36.9
  Top Layer w0.25: H11.3 78.99,52.2 H16.3
  Bottom Layer w0.2: U1.16 78.02,67.7 78.99,66.73 H11.3
RX: length 62.1
  Top Layer w0.2: v1(67.56,35.74) 67.56,66.47 69.85,68.76 73.15,68.76 75.18,70.79 P1.3
  Bottom Layer w0.2: U1.43 56.04,33.45 65.28,33.45 v1(67.56,35.74)
RX_USB: length 112.2
  Top Layer w0.2: U1.9 54.43,75.62 44.96,75.62 42.93,73.58 v1(42.93,50.22)
  Bottom Layer w0.2: H12.5 71.53,6.43 69.85,4.75 44.96,4.75 42.93,6.78 v1(42.93,50.22)
TX: length 60.7
  Top Layer w0.2: U1.42 57.31,34.72 67.56,34.72 68.33,35.48 68.33,66.47 70.1,68.25 74.42,68.25 77.72,71.55 P1.4
TX_USB: length 76.3
  Top Layer w0.2: U1.10 57.57,75.62 61.47,75.62 63.5,73.58 63.5,66.73 v1(64.77,65.46) ; H12.4 v1(68.99,64.95)
  Bottom Layer w0.2: v1(68.99,64.95) 68.48,65.46 v1(64.77,65.46)
WATER_1: length 87.6
  Top Layer w0.2: U3.1 87.12,84.25 9.91,84.25 8.73,85.43 U2.1
$1N4979: length 2.5
  Top Layer w0.2: U1.45 U1.47

## Copper pours and planes (outline as drawn; the poured copper is in the pictures)
GND on Top Layer: -10.16,105.59 112.52,105.59 112.52,-4.65 -10.16,-4.65
